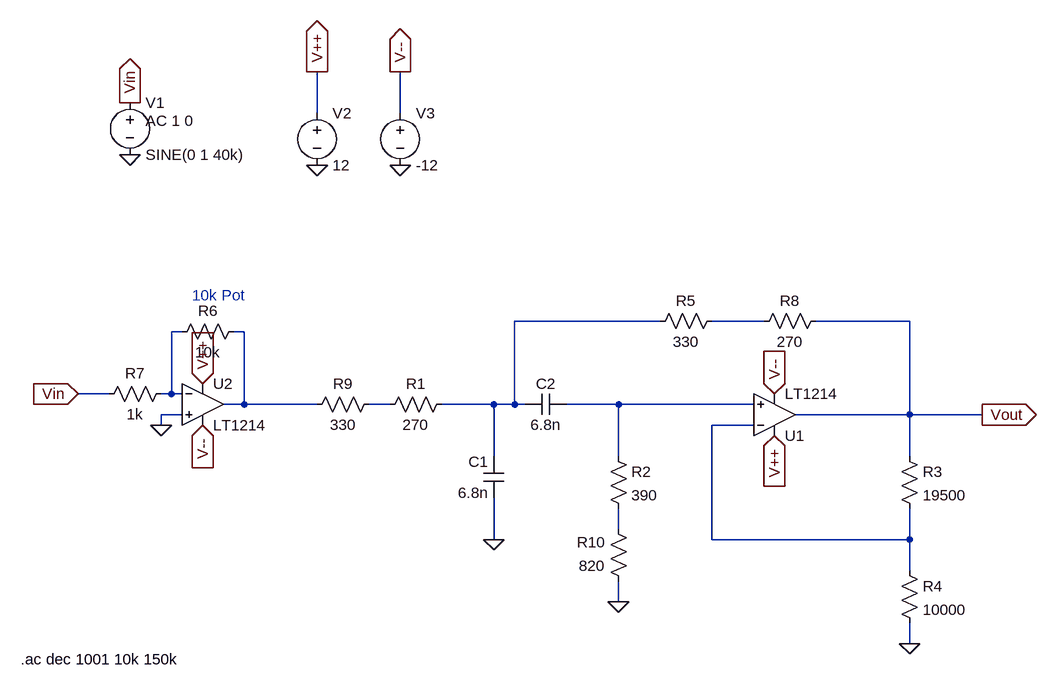
[diagram p0: schematic draftTxSallen.asc]
draftTxSallen.asc, the LTspice schematic file:
Version 4
SHEET 1 1120 680
WIRE -16 -320 -16 -384
WIRE 112 -320 112 -384
WIRE 512 0 288 0
WIRE 672 0 592 0
WIRE 896 0 752 0
WIRE -224 16 -240 16
WIRE -128 16 -144 16
WIRE -336 112 -384 112
WIRE -240 112 -240 16
WIRE -240 112 -256 112
WIRE -224 112 -240 112
WIRE -128 128 -128 16
WIRE -128 128 -160 128
WIRE -16 128 -128 128
WIRE 96 128 64 128
WIRE 256 128 176 128
WIRE 288 128 288 0
WIRE 288 128 256 128
WIRE 304 128 288 128
WIRE 448 128 368 128
WIRE 656 128 448 128
WIRE -224 144 -256 144
WIRE 896 144 896 0
WIRE 896 144 720 144
WIRE 1008 144 896 144
WIRE -256 160 -256 144
WIRE 656 160 592 160
WIRE 256 208 256 128
WIRE 448 208 448 128
WIRE 896 208 896 144
WIRE 448 320 448 288
WIRE 256 336 256 272
WIRE 592 336 592 160
WIRE 896 336 896 288
WIRE 896 336 592 336
WIRE 896 384 896 336
WIRE 448 432 448 400
WIRE 896 496 896 464
FLAG 256 336 0
FLAG -16 -240 0
FLAG 112 -240 0
FLAG 896 496 0
FLAG 1008 144 Vout
IOPIN 1008 144 Out
FLAG -16 -384 V++
IOPIN -16 -384 Out
FLAG 112 -384 V--
IOPIN 112 -384 Out
FLAG 688 176 V++
IOPIN 688 176 In
FLAG 688 112 V--
IOPIN 688 112 In
FLAG -304 -256 0
FLAG -304 -336 Vin
IOPIN -304 -336 Out
FLAG -256 160 0
FLAG -192 160 V--
IOPIN -192 160 In
FLAG -192 96 V++
IOPIN -192 96 In
FLAG -384 112 Vin
IOPIN -384 112 In
FLAG 448 432 0
SYMBOL res 192 112 R90
WINDOW 0 0 56 VBottom 2
WINDOW 3 32 56 VTop 2
SYMATTR InstName R1
SYMATTR Value 270
SYMBOL cap 272 272 R180
WINDOW 0 24 56 Left 2
WINDOW 3 24 8 Left 2
SYMATTR InstName C1
SYMATTR Value 6.8n
SYMBOL cap 368 112 R90
WINDOW 0 0 32 VBottom 2
WINDOW 3 32 32 VTop 2
SYMATTR InstName C2
SYMATTR Value 6.8n
SYMBOL res 432 192 R0
SYMATTR InstName R2
SYMATTR Value 390
SYMBOL voltage -16 -336 R0
WINDOW 123 0 0 Left 0
WINDOW 39 0 0 Left 0
SYMATTR InstName V2
SYMATTR Value 12
SYMBOL voltage 112 -336 R0
WINDOW 123 0 0 Left 0
WINDOW 39 0 0 Left 0
SYMATTR InstName V3
SYMATTR Value -12
SYMBOL res 880 192 R0
SYMATTR InstName R3
SYMATTR Value 19500
SYMBOL res 880 368 R0
SYMATTR InstName R4
SYMATTR Value 10000
SYMBOL res 608 -16 R90
WINDOW 0 0 56 VBottom 2
WINDOW 3 32 56 VTop 2
SYMATTR InstName R5
SYMATTR Value 330
SYMBOL voltage -304 -352 R0
WINDOW 123 24 44 Left 2
WINDOW 39 0 0 Left 0
SYMATTR Value2 AC 1 0
SYMATTR InstName V1
SYMATTR Value SINE(0 1 40k)
SYMBOL OpAmps\\LT1214 688 208 M180
SYMATTR InstName U1
SYMBOL Opamps\\LT1214 -192 64 R0
SYMATTR InstName U2
SYMBOL res -128 0 R90
WINDOW 0 0 56 VBottom 2
WINDOW 3 32 56 VTop 2
SYMATTR InstName R6
SYMATTR Value 10k
SYMBOL res -240 96 R90
WINDOW 0 0 56 VBottom 2
WINDOW 3 32 56 VTop 2
SYMATTR InstName R7
SYMATTR Value 1k
SYMBOL res 768 -16 R90
WINDOW 0 0 56 VBottom 2
WINDOW 3 32 56 VTop 2
SYMATTR InstName R8
SYMATTR Value 270
SYMBOL res 80 112 R90
WINDOW 0 0 56 VBottom 2
WINDOW 3 32 56 VTop 2
SYMATTR InstName R9
SYMATTR Value 330
SYMBOL res 464 416 R180
WINDOW 0 36 76 Left 2
WINDOW 3 36 40 Left 2
SYMATTR InstName R10
SYMATTR Value 820
TEXT -472 520 Left 2 !.ac dec 1001 10k 150k
TEXT -208 -40 Left 2 ;10k Pot

The netlist it stands for:
* draftTxSallen.asc
R1 N001 N005 270
C1 0 N001 6.8n
C2 N006 N001 6.8n
R2 N006 N008 390
V2 V++ 0 12
V3 V-- 0 -12
R3 Vout N007 19500
R4 N007 0 10000
R5 N002 N001 330
V1 Vin 0 SINE(0 1 40k) AC 1 0
XU1 N006 N007 V++ V-- Vout LT1213  ; LT1214, pins In+ In- V+ V- OUT
XU2 0 N003 V++ V-- N004 LT1213  ; LT1214, pins In+ In- V+ V- OUT
R6 N004 N003 10k
R7 N003 Vin 1k
R8 Vout N002 270
R9 N005 N004 330
R10 0 N008 820
.ac dec 1001 10k 150k
* 10k Pot
.lib LTC.lib
.backanno
.end